# Altium schematic sheet PERIPHERAL_PORT_IO.SchDoc: Peripheral Port IO
size B; Engineer: M. Jones; Organization: Michael Jones; DocumentNumber: 7; Revision: RA.1; SheetNumber: 7; SheetTotal: 7
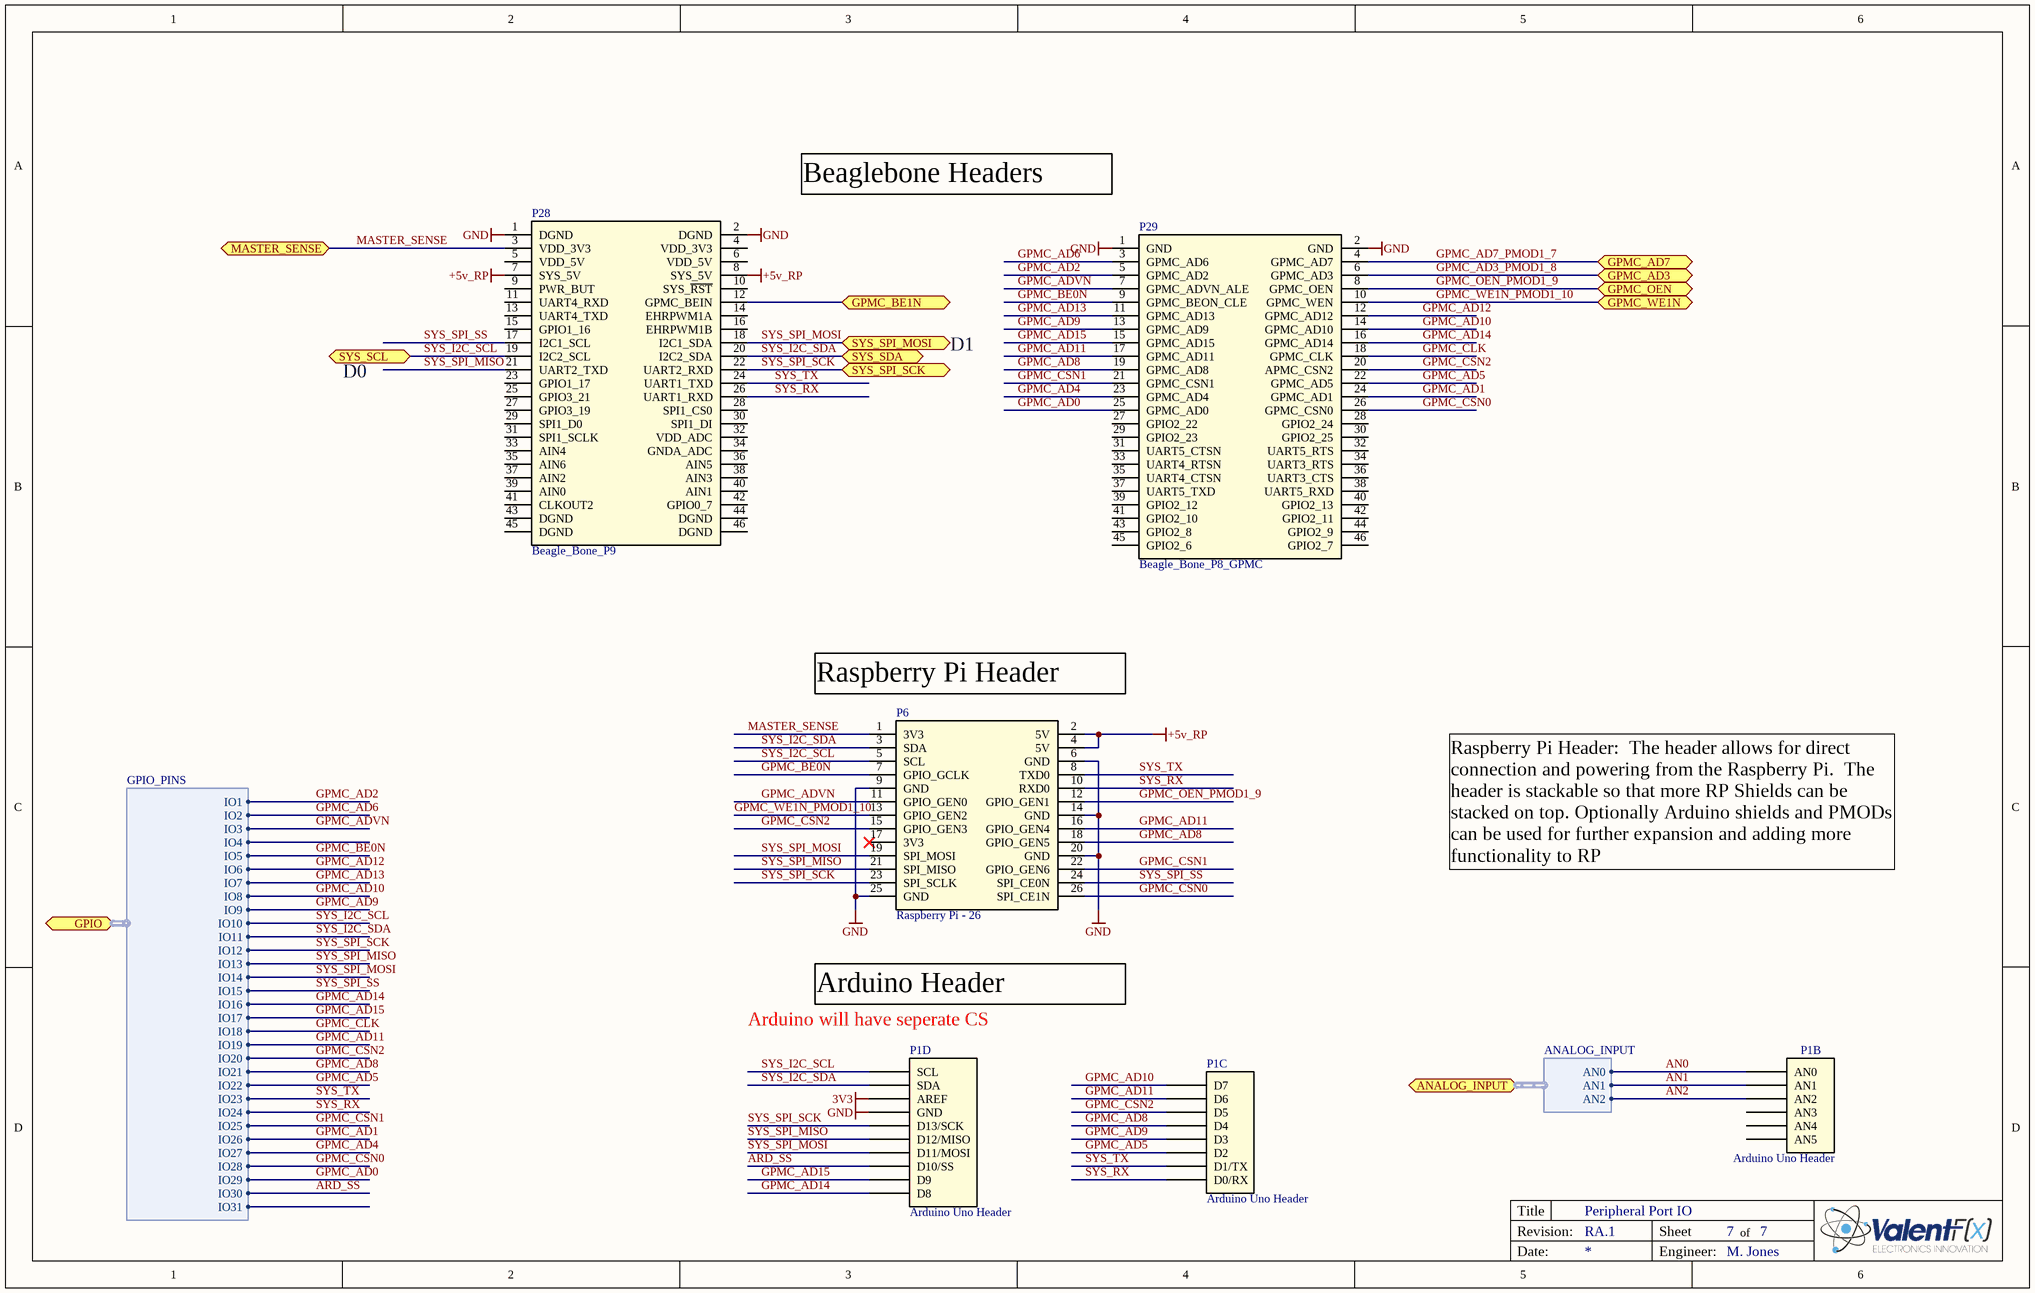
[diagram p0: PERIPHERAL_PORT_IO.SchDoc]

## Parts
P1  Arduino Uno Header  [Arduino Shield - smaller Thru]  (parts B,C,D of 4)
P6  Raspberry Pi - 26  [Raspberr Pi - 26]
P28  Beagle_Bone_P9  [TSM-116-01-F-DV_TH - SHRUNK]
P29  Beagle_Bone_P8_GPMC  [TSM-113-01-F-DV_TH - SHRUNK]

## Ports
ANALOG_INPUT (harness ANALOG_INPUT), GPIO (harness GPIO_PINS), GPMC_AD3, GPMC_AD7, GPMC_BE1N, GPMC_OEN, GPMC_WE1N, MASTER_SENSE, SYS_SCL, SYS_SDA, SYS_SPI_MOSI, SYS_SPI_SCK

## Harnesses
ANALOG_INPUT: AN0, AN1, AN2
GPIO_PINS: IO1, IO2, IO3, IO4, IO5, IO6, IO7, IO8, IO9, IO10, IO11, IO12, IO13, IO14, IO15, IO16, IO17, IO18, IO19, IO20, IO21, IO22, IO23, IO24, IO25, IO26, IO27, IO28, IO29, IO30, IO31

## Nets
3V3: P1.D8(AREF)
+5v_RP: P6.2(5V) P6.4(5V) P28.7(SYS_5V) P28.8(SYS_5V)
GND: P1.D7(GND) P6.6(GND) P6.9(GND) P6.14(GND) P6.20(GND) P6.25(GND) P28.1(DGND) P28.2(DGND) P29.1(GND) P29.2(GND)
AN0: P1.B1(AN0) ; port ANALOG_INPUT.AN0
AN1: P1.B2(AN1) ; port ANALOG_INPUT.AN1
AN2: P1.B3(AN2) ; port ANALOG_INPUT.AN2
ARD_SS: P1.D3(D10/SS) ; port GPIO.IO30
GPMC_AD0: P29.25(GPMC_AD0) ; port GPIO.IO29
GPMC_AD1: P29.24(GPMC_AD1) ; port GPIO.IO26
GPMC_AD2: P29.5(GPMC_AD2) ; port GPIO.IO1
GPMC_AD3_PMOD1_8: P29.6(GPMC_AD3) ; port GPMC_AD3
GPMC_AD4: P29.23(GPMC_AD4) ; port GPIO.IO27
GPMC_AD5: P1.C3(D2) P29.22(GPMC_AD5) ; port GPIO.IO22
GPMC_AD6: P29.3(GPMC_AD6) ; port GPIO.IO2
GPMC_AD7_PMOD1_7: P29.4(GPMC_AD7) ; port GPMC_AD7
GPMC_AD8: P1.C5(D4) P6.18(GPIO_GEN5) P29.19(GPMC_AD8) ; port GPIO.IO21
GPMC_AD9: P1.C4(D3) P29.13(GPMC_AD9) ; port GPIO.IO9
GPMC_AD10: P1.C8(D7) P29.14(GPMC_AD10) ; port GPIO.IO8
GPMC_AD11: P1.C7(D6) P6.16(GPIO_GEN4) P29.17(GPMC_AD11) ; port GPIO.IO19
GPMC_AD12: P29.12(GPMC_AD12) ; port GPIO.IO6
GPMC_AD13: P29.11(GPMC_AD13) ; port GPIO.IO7
GPMC_AD14: P1.D1(D8) P29.16(GPMC_AD14) ; port GPIO.IO16
GPMC_AD15: P1.D2(D9) P29.15(GPMC_AD15) ; port GPIO.IO17
GPMC_ADVN: P6.11(GPIO_GEN0) P29.7(GPMC_ADVN_ALE) ; port GPIO.IO3
GPMC_BE0N: P6.7(GPIO_GCLK) P29.9(GPMC_BEON_CLE) ; port GPIO.IO5
GPMC_BE1N: P28.12(GPMC_BEIN) ; port GPMC_BE1N
GPMC_CLK: P29.18(GPMC_CLK) ; port GPIO.IO18
GPMC_CSN0: P6.26(SPI_CE1N) P29.26(GPMC_CSN0) ; port GPIO.IO28
GPMC_CSN1: P6.22(GPIO_GEN6) P29.21(GPMC_CSN1) ; port GPIO.IO25
GPMC_CSN2: P1.C6(D5) P6.15(GPIO_GEN3) P29.20(APMC_CSN2) ; port GPIO.IO20
GPMC_OEN_PMOD1_9: P6.12(GPIO_GEN1) P29.8(GPMC_OEN) ; port GPMC_OEN
GPMC_WE1N_PMOD1_10: P6.13(GPIO_GEN2) P29.10(GPMC_WEN) ; port GPMC_WE1N
MASTER_SENSE: P6.1(3V3) P28.3(VDD_3V3) ; port MASTER_SENSE
SYS_I2C_SCL: P1.D10(SCL) P6.5(SCL) P28.19(I2C2_SCL) ; port SYS_SCL, port GPIO.IO10
SYS_I2C_SDA: P1.D9(SDA) P6.3(SDA) P28.20(I2C2_SDA) ; port SYS_SDA, port GPIO.IO11
SYS_RX: P1.C1(D0/RX) P6.10(RXD0) P28.26(UART1_RXD) ; port GPIO.IO24
SYS_SPI_MISO: P1.D5(D12/MISO) P6.21(SPI_MISO) P28.21(UART2_TXD) ; port GPIO.IO13
SYS_SPI_MOSI: P1.D4(D11/MOSI) P6.19(SPI_MOSI) P28.18(I2C1_SDA) ; port SYS_SPI_MOSI, port GPIO.IO14
SYS_SPI_SCK: P1.D6(D13/SCK) P6.23(SPI_SCLK) P28.22(UART2_RXD) ; port SYS_SPI_SCK, port GPIO.IO12
SYS_SPI_SS: P6.24(SPI_CE0N) P28.17(I2C1_SCL) ; port GPIO.IO15
SYS_TX: P1.C2(D1/TX) P6.8(TXD0) P28.24(UART1_TXD) ; port GPIO.IO23

Not connected (* = marked no-connect by the designer): P1 B4(AN3) B5(AN4) B6(AN5); P6 17(3V3)*; P28 4(VDD_3V3) 5(VDD_5V) 6(VDD_5V) 9(PWR_BUT) 10(SYS_~{RST}) 11(UART4_RXD) 13(UART4_TXD) 14(EHRPWM1A) 15(GPIO1_16) 16(EHRPWM1B) 23(GPIO1_17) 25(GPIO3_21) 27(GPIO3_19) 28(SPI1_CS0) 29(SPI1_D0) 30(SPI1_DI) 31(SPI1_SCLK) 32(VDD_ADC) 33(AIN4) 34(GNDA_ADC) 35(AIN6) 36(AIN5) 37(AIN2) 38(AIN3) 39(AIN0) 40(AIN1) 41(CLKOUT2) 42(GPIO0_7) 43(DGND) 44(DGND) 45(DGND) 46(DGND); P29 27(GPIO2_22) 28(GPIO2_24) 29(GPIO2_23) 30(GPIO2_25) 31(UART5_CTSN) 32(UART5_RTS) 33(UART4_RTSN) 34(UART3_RTS) 35(UART4_CTSN) 36(UART3_CTS) 37(UART5_TXD) 38(UART5_RXD) 39(GPIO2_12) 40(GPIO2_13) 41(GPIO2_10) 42(GPIO2_11) 43(GPIO2_8) 44(GPIO2_9) 45(GPIO2_6) 46(GPIO2_7)

## Notes on the sheet
- Beaglebone Headers
- D1
- D0
- (near P6) Raspberry Pi Header
- Raspberry Pi Header:  The header allows for direct connection and powering from the Raspberry Pi.  The header is stackable so that more RP Shields can be stacked on top. Optionally Arduino shields and PMODs can be used for further expansion and adding more functionality to RP
- (near P1) Arduino will have seperate CS
- Arduino Header
- Title
- Revision:
- Sheet
- of
- Date:
- Engineer:

## Library data of the parts
P1 = Arduino Shield: Arduino Duem Header